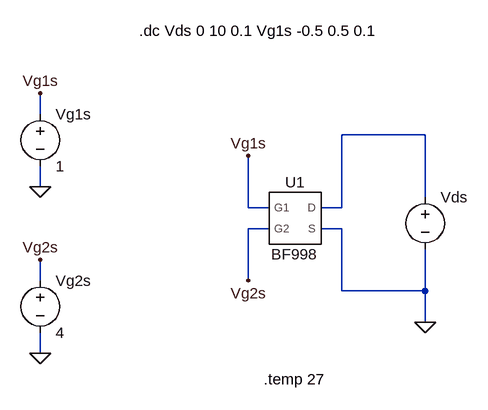
[diagram p0: schematic BF998_Id(Vds).asc]
BF998_Id(Vds).asc, the LTspice schematic file:
Version 4
SHEET 1 880 680
WIRE -192 16 -192 -16
WIRE 400 48 272 48
WIRE -192 128 -192 96
WIRE 400 144 400 48
WIRE 128 160 128 80
WIRE 160 160 128 160
WIRE 272 160 272 48
WIRE 272 160 240 160
WIRE 160 192 128 192
WIRE 272 192 240 192
WIRE -192 272 -192 240
WIRE 128 272 128 192
WIRE 272 288 272 192
WIRE 400 288 400 224
WIRE 400 288 272 288
WIRE 400 336 400 288
WIRE -192 384 -192 352
FLAG 400 336 0
FLAG -192 128 0
FLAG -192 -16 Vg1s
FLAG -192 384 0
FLAG -192 240 Vg2s
FLAG 128 80 Vg1s
FLAG 128 272 Vg2s
SYMBOL BF998 192 176 R0
SYMATTR InstName U1
SYMBOL voltage 400 128 R0
WINDOW 123 0 0 Left 0
WINDOW 39 0 0 Left 0
SYMATTR InstName Vds
SYMATTR Value ""
SYMBOL voltage -192 0 R0
WINDOW 123 0 0 Left 0
WINDOW 39 0 0 Left 0
SYMATTR InstName Vg1s
SYMATTR Value 1
SYMBOL voltage -192 256 R0
SYMATTR InstName Vg2s
SYMATTR Value 4
TEXT 152 424 Left 2 !.temp 27
TEXT -40 -112 Left 2 !.dc Vds 0 10 0.1 Vg1s -0.5 0.5 0.1

The netlist it stands for:
* BF998_Id(Vds).asc
XU1 0 N001 Vg2s Vg1s BF998  ; pins S D G2 G1
Vds N001 0
Vg1s Vg1s 0 1
Vg2s Vg2s 0 4
.temp 27
.dc Vds 0 10 0.1 Vg1s -0.5 0.5 0.1
.lib BF998.lib
.backanno
.end